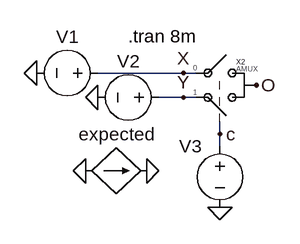
[diagram p0: schematic test-amux-2to1.asc]
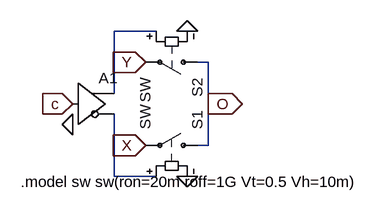
[diagram p1: sub-circuit amux-2to1.asc]
test-amux-2to1.asc, the LTspice schematic file:
Version 4
SHEET 1 880 680
WIRE 48 144 -64 144
WIRE 64 144 48 144
WIRE 48 176 16 176
WIRE 64 176 48 176
WIRE 96 224 96 208
WIRE 96 240 96 224
FLAG -64 176 0
FLAG -144 144 0
FLAG 96 320 0
FLAG 144 160 O
FLAG 48 144 X
FLAG 48 176 Y
FLAG 96 224 c
FLAG 0 272 0
FLAG -80 272 0
SYMBOL voltage -48 144 R90
WINDOW 0 -32 56 VBottom 2
WINDOW 3 32 56 Invisible 2
WINDOW 123 0 0 Left 0
WINDOW 39 0 0 Left 0
SYMATTR InstName V1
SYMATTR Value SINE(0 1 1k)
SYMBOL voltage 32 176 R90
WINDOW 0 -32 56 VBottom 2
WINDOW 3 32 56 Invisible 2
WINDOW 123 0 0 Left 0
WINDOW 39 0 0 Left 0
SYMATTR InstName V2
SYMATTR Value SINE(0 0.5 10k)
SYMBOL voltage 96 224 M0
WINDOW 3 24 96 Invisible 2
WINDOW 123 0 0 Left 0
WINDOW 39 0 0 Left 0
SYMATTR Value PULSE(0 1 2m 1n 1n 2m 4m)
SYMATTR InstName V3
SYMBOL amux-2to1 96 176 R0
SYMATTR InstName X2
SYMBOL bi -80 272 R270
WINDOW 0 32 40 VTop 2
WINDOW 3 -32 40 Invisible 2
SYMATTR InstName expected
SYMATTR Value I=IF(V(c),V(y),V(x))
SYMATTR Value2 Rpar=1
TEXT -24 96 Left 2 !.tran 8m

amux-2to1.asc, the sub-circuit schematic file:
Version 4
SHEET 1 880 680
WIRE 64 -160 0 -160
WIRE 144 -112 128 -112
WIRE 0 -64 0 -160
WIRE 144 -48 144 -112
WIRE 144 16 144 -48
WIRE 144 16 128 16
WIRE 0 64 0 -32
WIRE 64 64 0 64
FLAG 112 64 0
FLAG -64 -48 c
IOPIN -64 -48 In
FLAG 112 -160 0
FLAG 48 16 X
IOPIN 48 16 In
FLAG 48 -112 Y
IOPIN 48 -112 In
FLAG 144 -48 O
IOPIN 144 -48 Out
FLAG -64 -16 0
SYMBOL sw 144 16 M270
SYMATTR InstName S1
SYMBOL sw 144 -112 R90
SYMATTR InstName S2
SYMBOL Digital\\buf -64 -112 R0
SYMATTR InstName A1
TEXT -144 72 Left 0 !.model sw sw(ron=20m roff=1G Vt=0.5 Vh=10m)

The netlist it stands for:
* test-amux-2to1.asc
V1 X 0 SINE(0 1 1k)
V2 Y 0 SINE(0 0.5 10k)
V3 c 0 PULSE(0 1 2m 1n 1n 2m 4m)
XX2 c O X Y amux-2to1
B§expected 0 0 I=IF(V(c),V(y),V(x)) Rpar=1

* block symbol definitions
.subckt amux-2to1 c O X Y
S1 O X N002 0 SW
S2 O Y N001 0 SW
A1 c 0 0 0 0 N002 N001 0 BUF
.model sw sw(ron=20m roff=1G Vt=0.5 Vh=10m)
.ends amux-2to1

.tran 8m
.backanno
.end